# Altium schematic sheet Sheet2.SchDoc
size 594 x 420 mm; Address1: Address1; Address2: Address2; Address3: Address3; Address4: Address4; SheetNumber: 1; Scale: 1:1; DocumentType: Схема электрическая принципиальная; FirstReferrence: АБВГ.123456.001
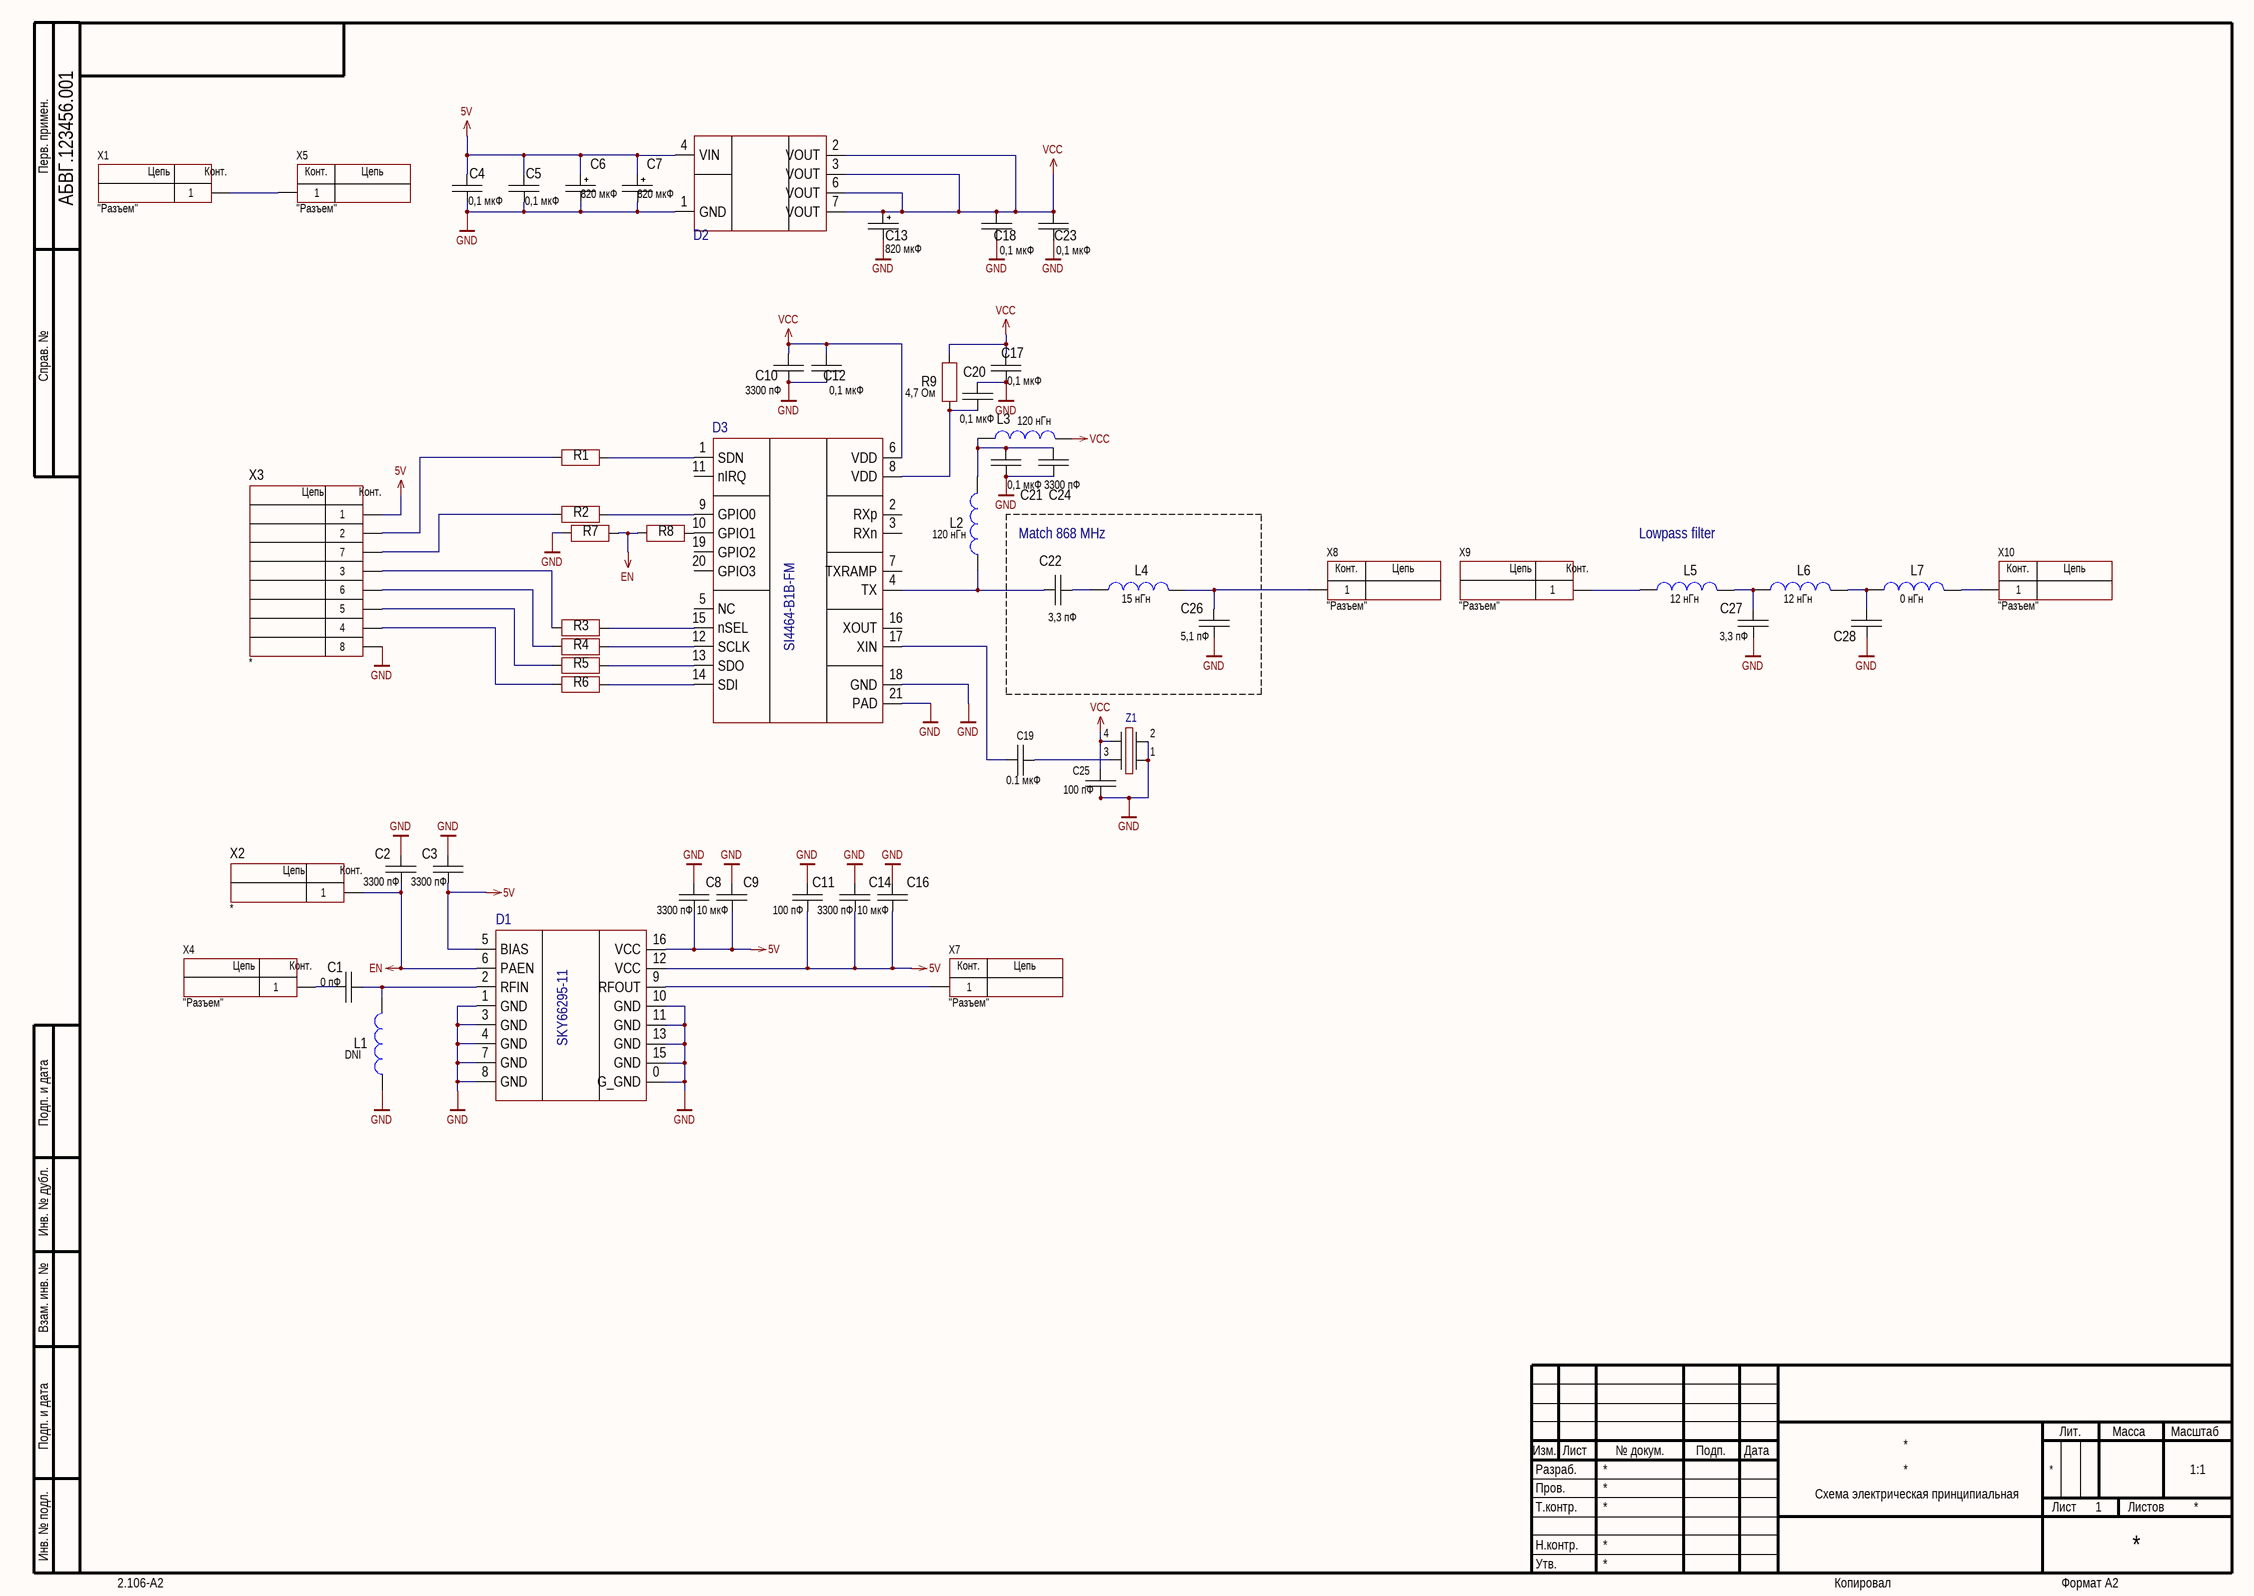
[diagram p0: Sheet2.SchDoc]

## Parts
C1  0 пФ  [CH0603C]
C2  3300 пФ  [CH0603C]
C3  3300 пФ  [CH0603C]
C4  0,1 мкФ  [CH0603C]
C5  0,1 мкФ  [CH0603C]
C6  820 мкФ  [D8C3.5H12]
C7  820 мкФ  [D8C3.5H12]
C8  3300 пФ  [CH0603C]
C9  10 мкФ  [CH1206C]
C10  3300 пФ  [CH0603C]
C11  100 пФ  [CH0603C]
C12  0,1 мкФ  [CH0603C]
C13  820 мкФ  [D8C3.5H12]
C14  3300 пФ  [CH0603C]
C16  10 мкФ  [CH1206C]
C17  0,1 мкФ  [CH0603C]
C18  0,1 мкФ  [CH0603C]
C19  value 0.1 мкФ  [CAP: 0603]
C20  0,1 мкФ  [CH0603C]
C21  0,1 мкФ  [CH0603C]
C22  3,3 пФ  [CH0603C]
C23  0,1 мкФ  [CH0603C]
C24  3300 пФ  [CH0603C]
C25  value 100 пФ  [CAP: 0603]
C26  5,1 пФ  [CH0603C]
C27  3,3 пФ  [CH0603C]
C28  10 пФ  [CH0603C]  (value not drawn)
D1  SKY66295-11  [16-LGA (5x5)]
D2  LD1117D33  [8-SOIC]  (value not drawn)
D3  SI4464-B1B-FM  [20-QFN (4x4)]
L1  DNI  [CH0603L]
L2  120 нГн  [CH0603L]
L3  120 нГн  [CH0603L]
L4  15 нГн  [CH0603L]
L5  12 нГн  [CH0603L]
L6  12 нГн  [CH0603L]
L7  0 нГн  [CH0603L]
R1  100 Ом  [CH0603R]  (value not drawn)
R2  100 Ом  [CH0603R]  (value not drawn)
R3  100 Ом  [CH0603R]  (value not drawn)
R4  100 Ом  [CH0603R]  (value not drawn)
R5  100 Ом  [CH0603R]  (value not drawn)
R6  100 Ом  [CH0603R]  (value not drawn)
R7  1 кОм  [CH0603R]  (value not drawn)
R8  1 кОм  [CH0603R]  (value not drawn)
R9  4,7 Ом  [CH0603R]
X1  CommentText: "Разъем"  [CON: SMA]
X2  *  [CON: PADS 1x1mm]  (no BOM)
X3  *  [CON: PLS-8]
X4  CommentText: "Разъем"  [CON: SMA]
X5  CommentText: "Разъем"  [CON: SMA]
X7  CommentText: "Разъем"  [CON: SMA]
X8  CommentText: "Разъем"  [CON: SMA]
X9  CommentText: "Разъем"  [CON: SMA]
X10  CommentText: "Разъем"  [CON: SMA]
Z1  JT33-B-K-3,3-LF-26,0MHz  [OSC: 3225]  (value not drawn)

## Blocks framed on the sheet
Match 868 MHz: C22 C26 L4

## Nets
5V: C3.1 C4.2 C5.2 C6.1 C7.1 C8.1 C9.1 C11.1 C14.1 C16.1 D1.5(BIAS) D1.12(VCC) D1.16(VCC) D2.4(VIN) X3.1
EN: C2.1 D1.6(PAEN) R7.1 R8.2 X2.1
GND: C2.2 C3.2 C4.1 C5.1 C6.2 C7.2 C8.2 C9.2 C10.1 C11.2 C12.1 C13.2 C14.2 C16.2 C17.1 C18.1 C20.2 C21.1 C23.1 C24.1 C25.1 C26.1 C27.1 C28.1 D1.0(G_GND) D1.1(GND) D1.3(GND) D1.4(GND) D1.7(GND) D1.8(GND) D1.10(GND) D1.11(GND) D1.13(GND) D1.15(GND) D2.1(GND) D3.18(GND) D3.21(PAD) L1.2 R7.2 X3.8 Z1.1 Z1.2
VCC: C10.2 C12.2 C13.1 C17.2 C18.2 C23.2 C25.2 D2.2(VOUT) D2.3(VOUT) D2.6(VOUT) D2.7(VOUT) D3.6(VDD) L3.1 R9.1 Z1.4
NetC1_1: C1.1 D1.2(RFIN) L1.1
NetC1_2: C1.2 X4.1
NetC19_1: C19.1 Z1.3
NetC19_2: C19.2 D3.17(XIN)
NetC20_1: C20.1 D3.8(VDD) R9.2
NetC21_2: C21.2 C24.2 L2.1 L3.2
NetC22_1: C22.1 L4.2
NetC22_2: C22.2 D3.4(TX) L2.2
NetC26_2: C26.2 L4.1 X8.1
NetC27_2: C27.2 L5.1 L6.2
NetC28_2: C28.2 L6.1 L7.2
NetD1_9: D1.9(RFOUT) X7.1
NetD3_1: D3.1(SDN) R1.1
NetD3_9: D3.9(GPIO0) R2.1
NetD3_10: D3.10(GPIO1) R8.1
NetD3_12: D3.12(SCLK) R4.1
NetD3_13: D3.13(SDO) R5.1
NetD3_14: D3.14(SDI) R6.1
NetD3_15: D3.15(nSEL) R3.1
NetL5_2: L5.2 X9.1
NetL7_1: L7.1 X10.1
NetR1_2: R1.2 X3.2
NetR2_2: R2.2 X3.7
NetR3_2: R3.2 X3.3
NetR4_2: R4.2 X3.6
NetR5_2: R5.2 X3.5
NetR6_2: R6.2 X3.4
NetX1_1: X1.1 X5.1

Not connected (* = marked no-connect by the designer): D3 2(RXp) 3(RXn) 5(NC) 7(TXRAMP) 11(nIRQ) 16(XOUT) 19(GPIO2) 20(GPIO3)

## Notes on the sheet
- Lowpass filter
- Перв. примен.
- Справ. №
- Подп. и дата
- Инв. № дубл.
- Взам. инв. №
- Разраб.
- Изм.
- Лист
- № докум.
- Подп.
- Дата
- Лит.
- Масса
- Масштаб
- Пров.
- Т.контр.
- Листов
- Инв. № подл.
- Утв.
- Н.контр.
- 2.106-A2
- Копировал
- Формат А2
- (in symbol 1-Connector) Цепь; Конт.
- (in symbol 8-Connector) Цепь; Конт.
- (in symbol Connector_SMA) Конт.; Цепь

## Library data of the parts
C1 = Capacitor: Manufacturer: MURATA; ValueManufacturerPartNumber: 0603-NP0-50В-0 пФ±5% MURATA; Tolerance: ±5%; Voltage: 50В; TypeDielectric: NP0; Model: *; HelpURL: *; ComponentKind: *; Value: 0 пФ; Package: 0603
C2 C3 C8 C10 C14 C24 = Capacitor: Manufacturer: MURATA; ValueManufacturerPartNumber: 0603-NP0-50В-3300 пФ±5% MURATA; Tolerance: ±5%; Voltage: 50В; TypeDielectric: NP0; Model: *; HelpURL: *; ComponentKind: *; Value: 3300 пФ; Package: 0603
C4 C5 C12 C17 C18 C20 C21 C23 = Capacitor: Manufacturer: MURATA; ValueManufacturerPartNumber: 0603-X7R-50В-0,1 мкФ±5% MURATA; Tolerance: ±5%; Voltage: 50В; TypeDielectric: X7R; Model: *; HelpURL: *; ComponentKind: *; Value: 0,1 мкФ; Package: 0603
C6 C7 C13 = AlumCap: Manufacturer: KEMET; Model: A755KS827M1AAAE014; HelpURL: *; ComponentKind: *; Value: 820 мкФ; Tolerance: *
C9 C16 = Capacitor: Manufacturer: MURATA; ValueManufacturerPartNumber: 1206-X7R-50В-10 мкФ±5% MURATA; Tolerance: ±5%; Voltage: 50В; TypeDielectric: X7R; Model: *; HelpURL: *; ComponentKind: *; Value: 10 мкФ; Package: 1206
C11 = Capacitor: Manufacturer: MURATA; ValueManufacturerPartNumber: 0603-NP0-50В-100 пФ±5% MURATA; Tolerance: ±5%; Voltage: 50В; TypeDielectric: NP0; Model: *; HelpURL: *; ComponentKind: *; Value: 100 пФ; Package: 0603
C19 = Ceramic_0603: Manufacturer: Yageo; PartNumber: CC0603KRX7R7BB104; ValueManufacturerPartNumber: Ceramic capacitor, 0.1 мкФ, X7R, ±10%, 16V, 0603, -55...+125°C; TypeCapacitor: Ceramic capacitor; Tolerance: ±10%; TypeDielectric: X7R; Voltage: 16V; Package: 0603; HelpURL: https://www.digikey.com/product-detail/en/yageo/CC0603KRX7R7BB104/311-1088-1-ND/302998; Temperature: -55...+125°C
C22 C27 = Capacitor: Manufacturer: MURATA; ValueManufacturerPartNumber: 0603-NP0-50В-3,3 пФ±5% MURATA; Tolerance: ±5%; Voltage: 50В; TypeDielectric: NP0; Model: *; HelpURL: *; ComponentKind: *; Value: 3,3 пФ; Package: 0603
C25 = Ceramic_0603: Manufacturer: Yageo; PartNumber: CC0603KRX7R7BB104; ValueManufacturerPartNumber: Ceramic capacitor, 100 пФ, NP0, ±10%, 16V, 0603, -55...+125°C; TypeCapacitor: Ceramic capacitor; Tolerance: ±10%; TypeDielectric: NP0; Voltage: 16V; Package: 0603; HelpURL: https://www.digikey.com/product-detail/en/yageo/CC0603KRX7R7BB104/311-1088-1-ND/302998; Temperature: -55...+125°C
C26 = Capacitor: Manufacturer: MURATA; ValueManufacturerPartNumber: 0603-NP0-50В-5,1 пФ±5% MURATA; Tolerance: ±5%; Voltage: 50В; TypeDielectric: NP0; Model: *; HelpURL: *; ComponentKind: *; Value: 5,1 пФ; Package: 0603
C28 = Capacitor: Manufacturer: MURATA; ValueManufacturerPartNumber: 0603-NP0-50В-10 пФ±5% MURATA; Tolerance: ±5%; Voltage: 50В; TypeDielectric: NP0; Model: *; HelpURL: *; ComponentKind: *; Value: 10 пФ; Package: 0603
D1 = SKY66295-11: 800 to 900 MHz High-Efficiency 4 W Power Amplifier; ValueManufacturerPartNumber: SKY66295-11 *; Model: SKY66295-11; Manufacturer: *
D2 = LD1117D33: Manufacturer: ST MICROELECTRONICS; Model: LD1117D33; HelpURL: https://www.digikey.com/en/products/detail/stmicroelectronics/LD1117D33TR/1165909; Package: SOIC-8
D3 = SI4464: RF Transceiver FSK/GFSK/GMSK/MSK/OOK 3.3V 20-Pin QFN; Manufacturer: SILICON LABS; ValueManufacturerPartNumber: SI4464-B1B-FM SILICON LABS; Model: SI4464-B1B-FM; Package: QFN-20; URL: https://www.silabs.com/wireless/proprietary/ezradiopro-sub-ghz-ics/device.si4464
L1 = Inductor: ValueManufacturerPartNumber: * DNI ±5% *; Tolerance: ±5%; Manufacturer: *; Model: *; HelpURL: *; ComponentKind: *; Value: DNI
L2 L3 = Inductor: ValueManufacturerPartNumber: * 120 нГн ±5% *; Tolerance: ±5%; Manufacturer: *; Model: *; HelpURL: *; ComponentKind: *; Value: 120 нГн
L4 = Inductor: ValueManufacturerPartNumber: * 15 нГн ±5% *; Tolerance: ±5%; Manufacturer: *; Model: *; HelpURL: *; ComponentKind: *; Value: 15 нГн
L5 L6 = Inductor: ValueManufacturerPartNumber: * 12 нГн ±5% *; Tolerance: ±5%; Manufacturer: *; Model: *; HelpURL: *; ComponentKind: *; Value: 12 нГн
L7 = Inductor: ValueManufacturerPartNumber: * 0 нГн ±5% *; Tolerance: ±5%; Manufacturer: *; Model: *; HelpURL: *; ComponentKind: *; Value: 0 нГн
R1-R6 = Resistor: Manufacturer: YAGEO; ValueManufacturerPartNumber: RC0603-0,1-100 Ом ± 5% YAGEO; Tolerance: ± 5%; Power: 0,1; Prefix: RC; Model: *; HelpURL: *; ComponentKind: Резистор; Value: 100 Ом; Package: 0603
R7 R8 = Resistor: Manufacturer: YAGEO; ValueManufacturerPartNumber: RC0603-0,1-1 кОм ± 5% YAGEO; Tolerance: ± 5%; Power: 0,1; Prefix: RC; Model: *; HelpURL: *; ComponentKind: Резистор; Value: 1 кОм; Package: 0603
R9 = Resistor: Manufacturer: YAGEO; ValueManufacturerPartNumber: RC0603-0,1-4,7 Ом ± 5% YAGEO; Tolerance: ± 5%; Power: 0,1; Prefix: RC; Model: *; HelpURL: *; ComponentKind: Резистор; Value: 4,7 Ом; Package: 0603
X1 X4 X5 X7-X10 = Connector_SMA: Manufacturer: TE Connectivity; ValueManufacturerPartNumber: Connector SMA, 50 Ohm, 3GHz; PartNumber: 5-1814832-1; TypeConnector: Connector SMA; Frequency: 3GHz; Impedance: 50 Ohm; HelpURL: https://www.digikey.com/product-detail/en/te-connectivity-amp-connectors/5-1814832-1/A97594-ND/1755982
X2 = 1-Connector: Model: *; Manufacturer: *; HelpURL: *; ComponentKind: *
X3 = 8-Connector: Model: *; Manufacturer: *; HelpURL: *; ComponentKind: *
Z1 = Oscilator_3225: Manufacturer: JAUCH; Model: JT33-B-K-3,3-LF-26,0MHz; Package: 3.2mm x 2.5mm; HelpURL: https://www.jauch.com/downloadfile/57ff72b1b7707_2612e42791cc621776f7/jt33_190222_online.pdf